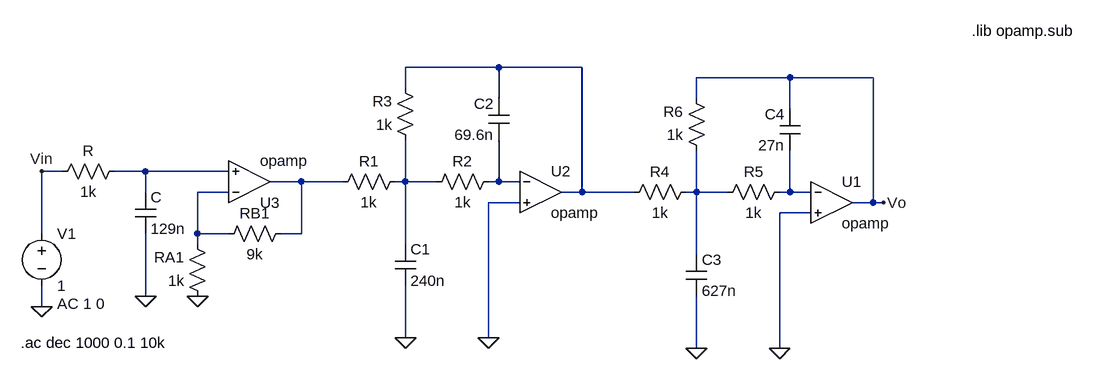
[diagram p0: schematic Ex3_2.asc]
Ex3_2.asc, the LTspice schematic file:
Version 4
SHEET 1 1060 680
WIRE 160 -96 16 -96
WIRE 288 -96 160 -96
WIRE 608 -80 464 -80
WIRE 736 -80 608 -80
WIRE 16 -64 16 -96
WIRE 160 -48 160 -96
WIRE 464 -48 464 -80
WIRE 608 -32 608 -80
WIRE -512 64 -544 64
WIRE -384 64 -432 64
WIRE -256 64 -384 64
WIRE -144 80 -192 80
WIRE -80 80 -144 80
WIRE 16 80 16 16
WIRE 16 80 0 80
WIRE 64 80 16 80
WIRE 160 80 160 16
WIRE 160 80 144 80
WIRE 192 80 160 80
WIRE -384 96 -384 64
WIRE -256 96 -304 96
WIRE 288 96 288 -96
WIRE 288 96 256 96
WIRE 368 96 288 96
WIRE 464 96 464 32
WIRE 464 96 448 96
WIRE 512 96 464 96
WIRE 608 96 608 32
WIRE 608 96 592 96
WIRE 640 96 608 96
WIRE 192 112 144 112
WIRE 736 112 736 -80
WIRE 736 112 704 112
WIRE 752 112 736 112
WIRE 640 128 592 128
WIRE -544 160 -544 64
WIRE -304 160 -304 96
WIRE -256 160 -304 160
WIRE -144 160 -144 80
WIRE -144 160 -176 160
WIRE -304 176 -304 160
WIRE 16 176 16 80
WIRE 464 192 464 96
WIRE -384 256 -384 160
WIRE -544 272 -544 240
WIRE 16 320 16 240
WIRE 144 320 144 112
WIRE 464 336 464 256
WIRE 592 336 592 128
FLAG -544 272 0
FLAG -304 256 0
FLAG 16 320 0
FLAG 144 320 0
FLAG -544 64 Vin
FLAG -384 256 0
FLAG 464 336 0
FLAG 592 336 0
FLAG 752 112 Vo
SYMBOL voltage -544 144 R0
WINDOW 123 24 124 Left 2
WINDOW 39 0 0 Left 0
SYMATTR Value2 AC 1 0
SYMATTR InstName V1
SYMATTR Value 1
SYMBOL OpAmps\\opamp 224 32 R0
SYMATTR InstName U2
SYMBOL OpAmps\\opamp -224 144 M180
SYMATTR InstName U3
SYMBOL res -416 48 R90
WINDOW 0 0 56 VBottom 2
WINDOW 3 32 56 VTop 2
SYMATTR InstName R
SYMATTR Value 1k
SYMBOL res 16 64 R90
WINDOW 0 0 56 VBottom 2
WINDOW 3 32 56 VTop 2
SYMATTR InstName R1
SYMATTR Value 1k
SYMBOL cap 0 176 R0
SYMATTR InstName C1
SYMATTR Value 240n
SYMBOL cap 176 16 R180
WINDOW 0 24 56 Left 2
WINDOW 3 24 8 Left 2
SYMATTR InstName C2
SYMATTR Value 69.6n
SYMBOL res 32 32 R180
WINDOW 0 36 76 Left 2
WINDOW 3 36 40 Left 2
SYMATTR InstName R3
SYMATTR Value 1k
SYMBOL res -288 272 R180
WINDOW 0 36 76 Left 2
WINDOW 3 36 40 Left 2
SYMATTR InstName RA1
SYMATTR Value 1k
SYMBOL res -272 176 R270
WINDOW 0 32 56 VTop 2
WINDOW 3 0 56 VBottom 2
SYMATTR InstName RB1
SYMATTR Value 9k
SYMBOL cap -400 96 R0
SYMATTR InstName C
SYMATTR Value 129n
SYMBOL res 160 64 R90
WINDOW 0 0 56 VBottom 2
WINDOW 3 32 56 VTop 2
SYMATTR InstName R2
SYMATTR Value 1k
SYMBOL OpAmps\\opamp 672 48 R0
SYMATTR InstName U1
SYMBOL res 464 80 R90
WINDOW 0 0 56 VBottom 2
WINDOW 3 32 56 VTop 2
SYMATTR InstName R4
SYMATTR Value 1k
SYMBOL cap 448 192 R0
SYMATTR InstName C3
SYMATTR Value 627n
SYMBOL cap 624 32 R180
WINDOW 0 24 56 Left 2
WINDOW 3 24 8 Left 2
SYMATTR InstName C4
SYMATTR Value 27n
SYMBOL res 480 48 R180
WINDOW 0 36 76 Left 2
WINDOW 3 36 40 Left 2
SYMATTR InstName R6
SYMATTR Value 1k
SYMBOL res 608 80 R90
WINDOW 0 0 56 VBottom 2
WINDOW 3 32 56 VTop 2
SYMATTR InstName R5
SYMATTR Value 1k
TEXT 888 -152 Left 2 !.lib opamp.sub
TEXT -576 328 Left 2 !.ac dec 1000 0.1 10k

The netlist it stands for:
* Ex3_2.asc
V1 Vin 0 1 AC 1 0
XU2 N005 0 N001 opamp Aol=100K GBW=10Meg  ; pins invin noninvin out
XU3 N006 N002 N003 opamp Aol=100K GBW=10Meg  ; pins invin noninvin out
R N002 Vin 1k
R1 N004 N003 1k
C1 N004 0 240n
C2 N005 N001 69.6n
R3 N004 N001 1k
RA1 0 N006 1k
RB1 N006 N003 9k
C N002 0 129n
R2 N005 N004 1k
XU1 N008 0 Vo opamp Aol=100K GBW=10Meg  ; pins invin noninvin out
R4 N007 N001 1k
C3 N007 0 627n
C4 N008 Vo 27n
R6 N007 Vo 1k
R5 N008 N007 1k
.lib opamp.sub
.ac dec 1000 0.1 10k
.backanno
.end